# EAGLE design simple_alarm (EAGLE 5.09)
REV: 0.1
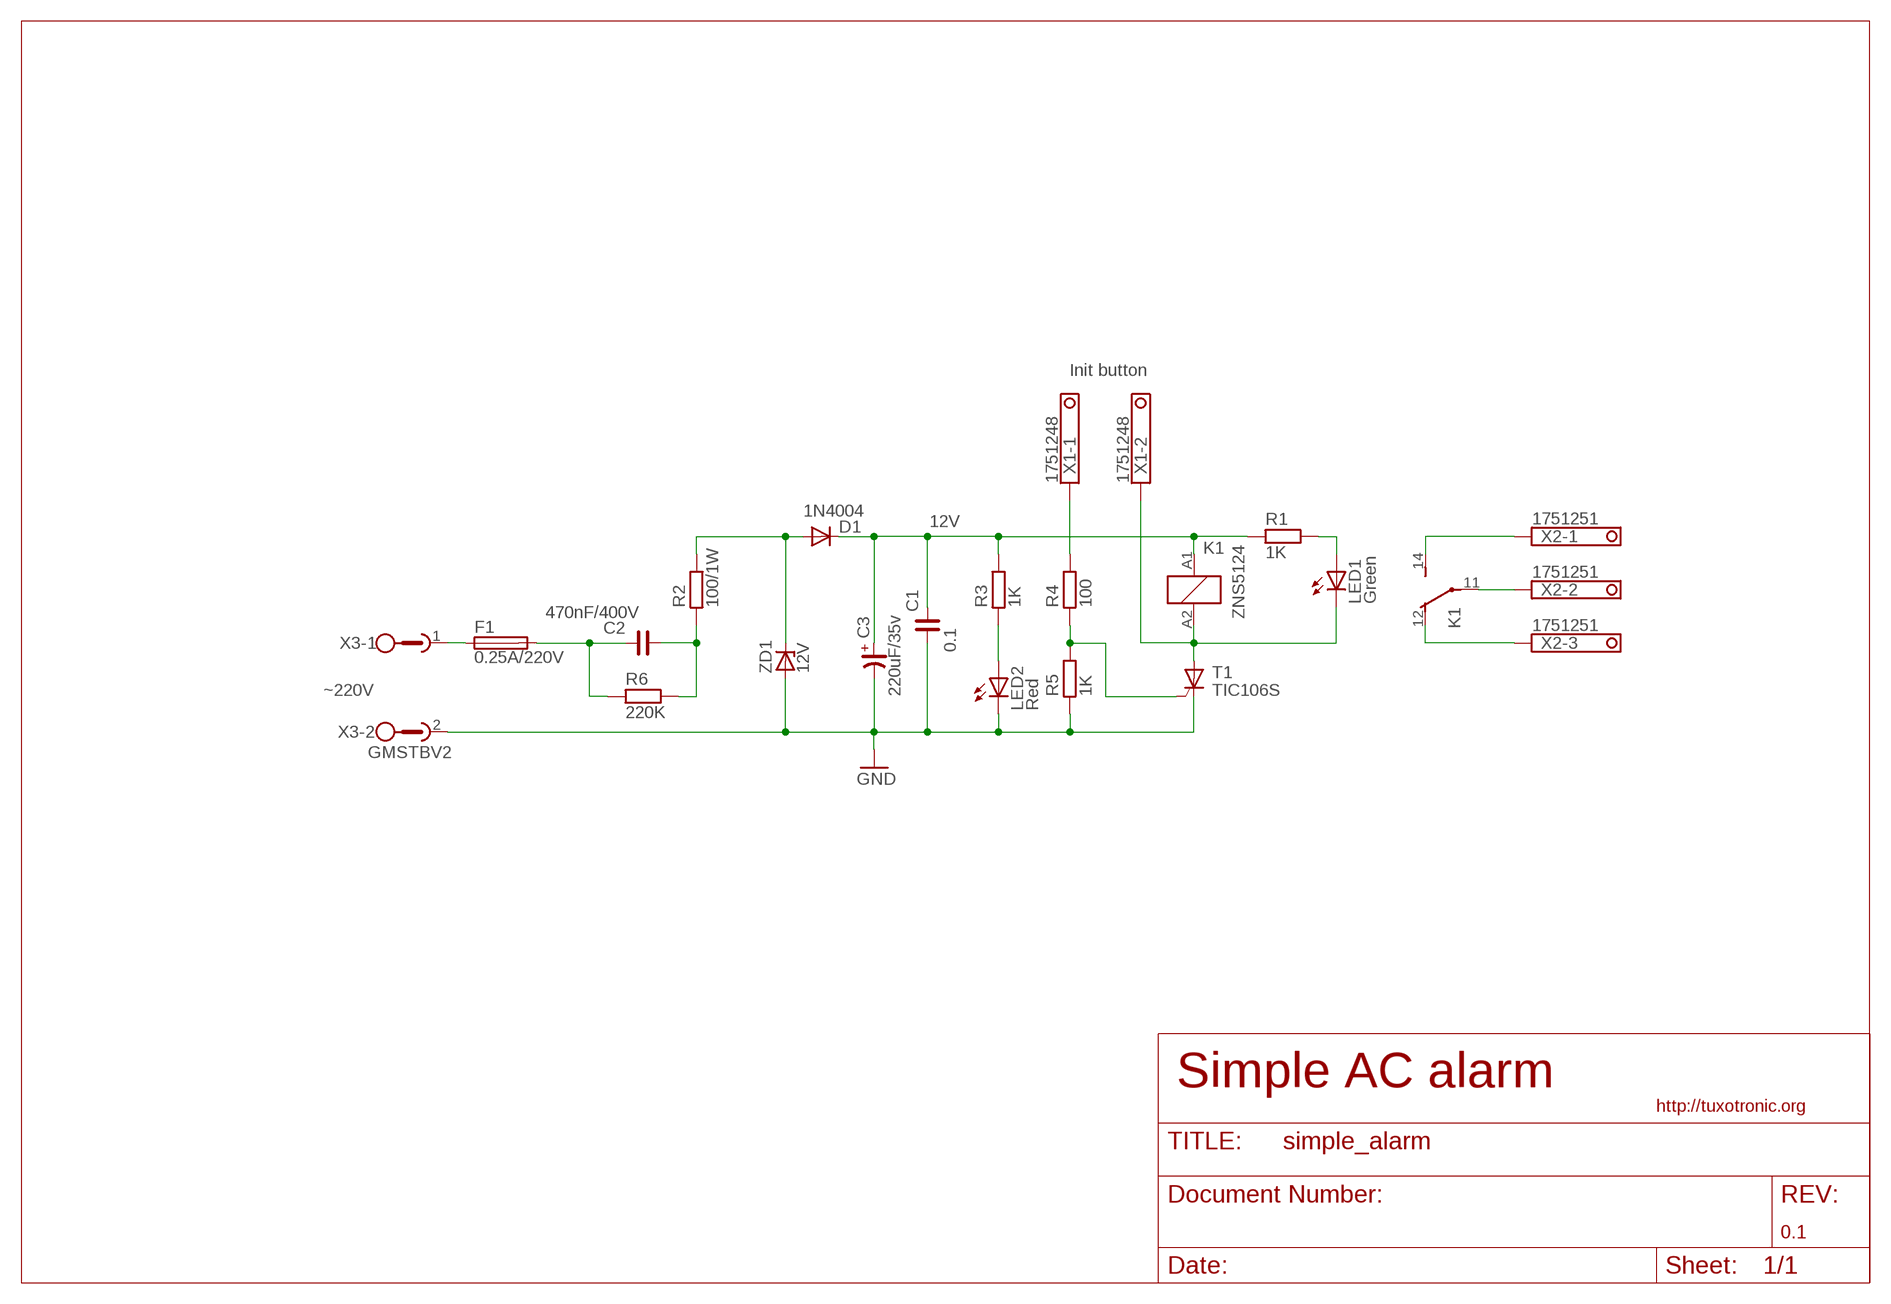
[diagram p0: schematic, sheet 1]

## Parts
C1  0.1  C_C025-050X025  [C025-050X025]
C2  470nF/400V  C_C200-230X080  [C200-230X080]
C3  220uF/35v  CP_TT050-080  [CTT-050-080]
D1  1N4004  DIODE-DO41-10  [DO41-10]
F1  0.25A/220V  PICOFUSE  [PICOFUSE]
K1  ZNS5124  [ZN5]
LED1  Green  LED5MM  [LED5MM]
LED2  Red  LED5MM  [LED5MM]
R1  1K  R_X0309/10  [0309/10]
R2  100/1W  R_X0309/12  [0309/12]
R3  1K  R_X0309/10  [0309/10]
R4  100  R_X0309/10  [0309/10]
R5  1K  R_X0309/10  [0309/10]
R6  220K  R_X0309/10  [0309/10]
T1  TIC106S  [TIC106S]
X1  1751248  [1751248]
X2  1751251  [1751251]
X3  GMSTBV2  [GMSTBV2]
ZD1  12V  BZD23  [SOD81]

## Nets
12V: C1.2 C3.+ D1.C K1.A1 R1.1 R3.2
GND: C1.1 C3.- LED2.K(C) R5.1 T1.C X3.2 ZD1.A
HOT: C2.1 F1.2 R6.1
N$1: F1.1 X3.1
N$2: C2.2 R2.1 R6.2
N$3: D1.A R2.2 ZD1.C
N$4: R4.2 X1.1
N$5: LED2.A R3.1
N$6: K1.A2 LED1.K(C) T1.A X1.2
N$7: R4.1 R5.2 T1.G
N$8: K1.12(2:O) X2.3
N$9: K1.11(2:P) X2.2
N$10: K1.14(2:S) X2.1
N$11: LED1.A R1.2

## Notes on the sheet
- Init button
- ~220V
- Simple AC alarm

## Library data of the parts
C1 C2 = rc-master:C_: NON-POLARIZED CAP
C3 = rc-master:CP_: POLARIZED CAP
D1 = discrete:DIODE-: DIODE
F1 = fuse:PICOFUSE: PICOFUSE 19275, Wickmann
K1 = myrelays:ZNS5*: Miniature Power PCB Relay SCHRACK 1pole 10 A Source: http://www.schrack.com/.. 5847.pdf
LED1 LED2 = led:LED: LED OSRAM: - CHIPLED LG R971, LG N971, LY N971, LG Q971, LY Q971, LO R971, LY R971 LH N974, LH R974 LS Q976, LO Q976, LY Q976 LO Q996 - Hyper CHIPLED LW Q18S LB Q993, LB Q99A, LB R99A - SideLED LS A670, LO A670, LY A670, LG A670, LP A670 LB A673, LV A673, LT A673, LW A673 LH A674 LY A675 LS A676, LA A676, LO A676, LY A676, LW A676 LS A679, LY A679, LG A679 - Hyper Micro SIDELED® LS Y876, LA Y876, LO Y876, LY Y876 LT Y87S - SmartLED LW L88C, LW L88S LB L89C, LB L89S, LG L890 LS L89K, LO L89K, LY L89K LS L896, LA L896, LO L896, LY L896 - TOPLED LS T670, LO T670, LY T670, LG T670, LP T670 LSG T670, LSP T670, LSY T670, LOP T670, LYG T670 LG T671, LOG T671, LSG T671 LB T673, LV T673, LT T673, LW T673 LH T674 LS T676, LA T676, LO T676, LY T676, LB T676, LH T676, LSB T676, LW T676 LB T67C, LV T67C, LT T67C, LS T67K, LO T67K, LY T67K, LW E67C LS E67B, LA E67B, LO E67B, LY E67B, LB E67C, LV E67C, LT E67C LW T67C LS T679, LY T679, LG T679 LS T770, LO T770, LY T770, LG T770, LP T770 LB T773, LV T773, LT T773, LW T773 LH T774 LS E675, LA E675, LY E675, LS T675 LS T776, LA T776, LO T776, LY T776, LB T776 LHGB T686 LT T68C, LB T68C - Hyper Mini TOPLED® LB M676 - Mini TOPLED Santana® LG M470 LS M47K, LO M47K, LY M47K Source: http://www.osram.convergy.de - LUMILED® LXK2-PW12-R00, LXK2-PW12-S00, LXK2-PW14-U00, LXK2-PW14-V00 LXK2-PM12-R00, LXK2-PM12-S00, LXK2-PM14-U00 LXK2-PE12-Q00, LXK2-PE12-R00, LXK2-PE12-S00, LXK2-PE14-T00, LXK2-PE14-U00 LXK2-PB12-K00, LXK2-PB12-L00, LXK2-PB12-M00, LXK2-PB14-N00, LXK2-PB14-P00, LXK2-PB14-Q00 LXK2-PR12-L00, LXK2-PR12-M00, LXK2-PR14-Q00, LXK2-PR14-R00 LXK2-PD12-Q00, LXK2-PD12-R00, LXK2-PD12-S00 LXK2-PH12-R00, LXK2-PH12-S00 LXK2-PL12-P00, LXK2-PL12-Q00, LXK2-PL12-R00 Source: www.luxeon.com
R1-R6 = rc-master:R_: RESISTOR
T1 = triac:TIC106S: THYRISTOR
X1 = con-phoenix-350:1751248: MKDS 1/ 2-3,5 Printklemme Nennstrom: 10 A Bemessungsspannung: 160 V Raster: 3,5 mm Polzahl: 2 Montageart: Löten Anschlussart: Schraubanschluss Anschlussrichtung vom Leiter zur Platine: 0° Source: http://eshop.phoenixcontact.com .. 1751248.pdf
X2 = con-phoenix-350:1751251: MKDS 1/ 3-3,5 Printklemme Nennstrom: 10 A Bemessungsspannung: 160 V Raster: 3,5 mm Polzahl: 3 Montageart: Löten Anschlussart: Schraubanschluss Anschlussrichtung vom Leiter zur Platine: 0° Source: http://eshop.phoenixcontact.com .. 1751251.pdf
X3 = con-phoenix-508:GMSTBV2: PHOENIX
ZD1 = diode:BZD23: Z DIODE

## Board
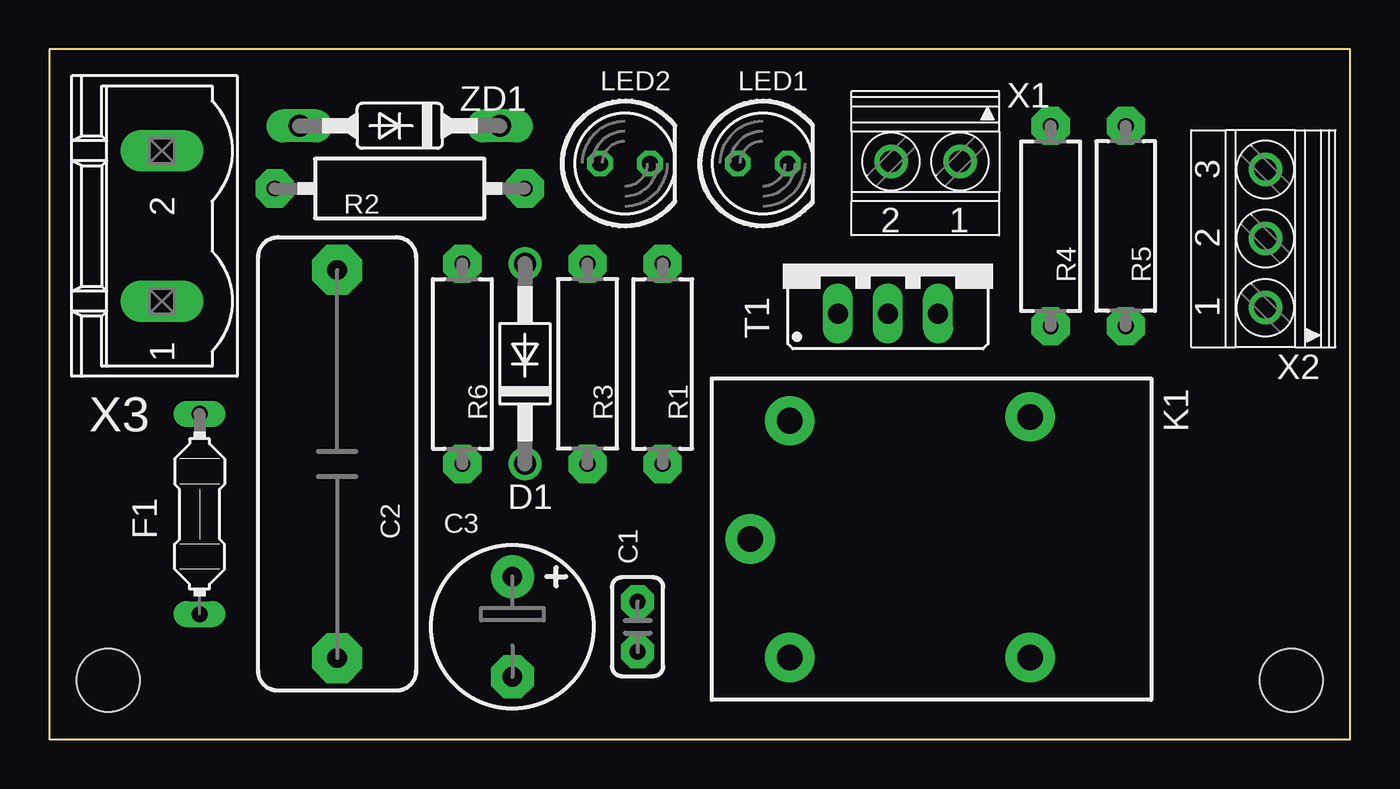
[diagram p1: board, top side]
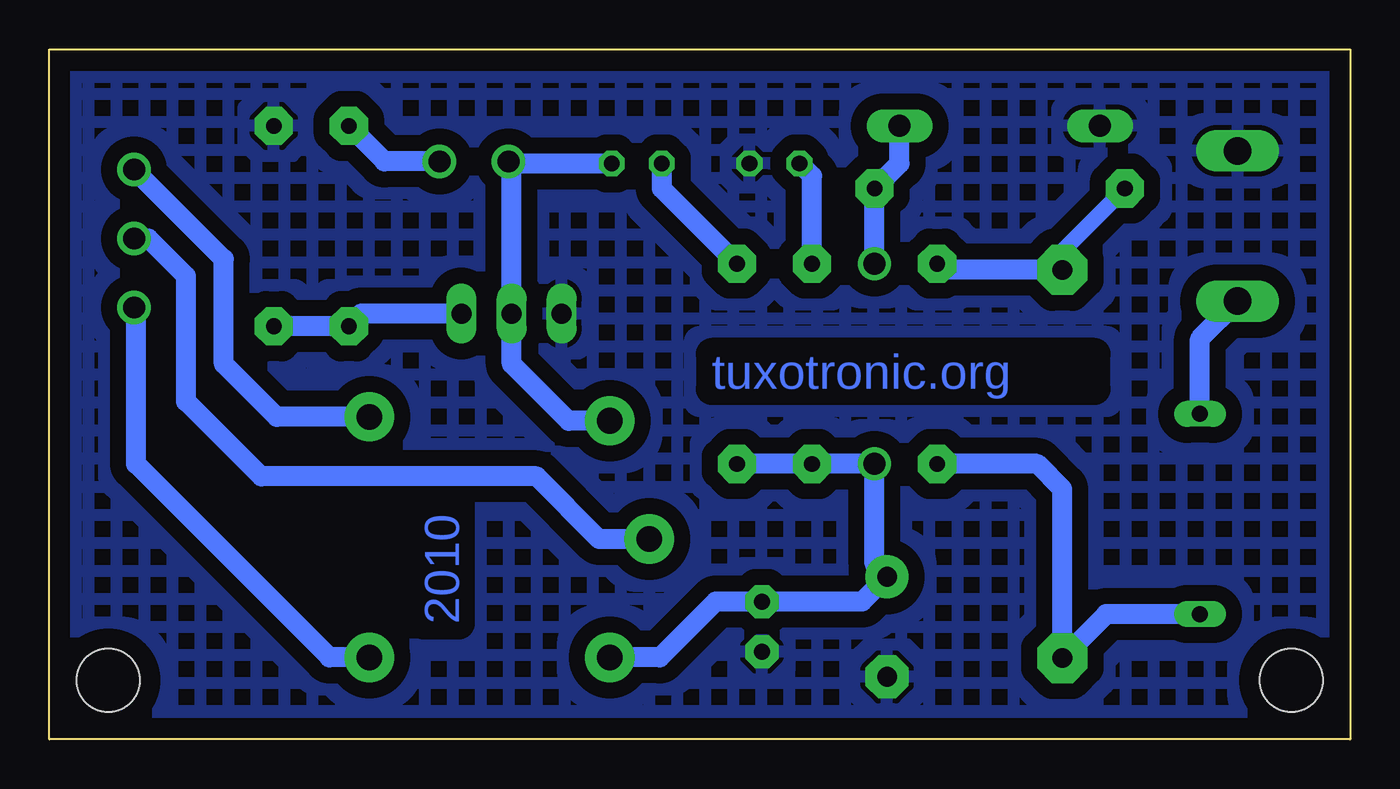
[diagram p2: board, bottom side, seen from below]

Size 66 x 35 mm. Coordinates in mm from the lower left corner, seen from the top.
Outline: 0,0 66,0 66,35 0,35 0,0
Copper layers (1*16): Top 0.035mm / dielectric 1.5mm / Bottom 0.035mm
Design rules "default": minimum track width 10mil, minimum drill 24mil, track to track 8mil, track to pad 8mil, pad to pad 8mil, via to via 8mil, smd to smd 8mil, copper to edge 40mil, drill to drill 8mil, minimum pad ring 10mil, minimum via ring 8mil, stop-mask expansion 4mil, vias tented up to drill 0mil, thermal gap 10mil
Holes 3.2 mm at 3,3 63,3

### Footprints (pad centres in the part's own frame; a part is rotated, then mirrored left to right if it is on the bottom)
C025-050X025 = drill 0.8 pad 1.676 octagon: 1 -1.27,0; 2 1.27,0
C200-230X080 = drill 1 pad 2.54 octagon: 1 -9.842,0; 2 9.842,0
CTT-050-080 = drill 1 pad 2.184 round: + -2.54,0 | drill 1 pad 2.184 octagon: - 2.54,0
DO41-10 = drill 1.118 round: A 5.08,0; C -5.08,0
PICOFUSE = drill 0.813 long: 1 -5.08,0; 2 5.08,0
ZN5 = drill 1.3 pad 2.5 round: 11 8.89,0; 12 -5.31,-6.2; 14 -5.31,6; A1 6.89,6; A2 6.89,-6
LED5MM = drill 0.8 octagon: A -1.27,0; K 1.27,0
0309/10 = drill 0.8 pad 1.93 octagon: 1 -5.08,0; 2 5.08,0
0309/12 = drill 0.8 pad 1.93 octagon: 1 -6.35,0; 2 6.35,0
TIC106S = drill 1.016 long: A 0,-2.54; C -2.54,-2.54; G 2.54,-2.54
1751248 = drill 1.1 pad 1.7 round: 1 -1.75,-0.1; 2 1.75,-0.1
1751251 = drill 1.1 pad 1.7 round: 1 -3.5,-0.1; 2 0,-0.1; 3 3.5,-0.1
GMSTBV2 = drill 1.4 long: 1 -3.81,0; 2 3.81,0
SOD81 = drill 1.118 long: A 5.08,0; C -5.08,0

### Placement (x,y rotation side)
C1  29.84,5.71 90 top
C2  14.61,13.97 90 top
C3  23.5,5.71 270 top
D1  24.13,19.05 90 top
F1  7.62,11.43 270 top
K1  44.45,10.16 180 top
LED1  36.2,29.21 0 top
LED2  29.21,29.21 0 top
R1  31.11,19.05 90 top
R2  17.78,27.94 0 top
R3  27.3,19.05 270 top
R4  50.8,26.04 90 top
R5  54.61,26.04 270 top
R6  20.95,19.05 90 top
T1  42.55,24.13 0 top
X1  44.45,29.21 180 top
X2  61.59,25.4 90 top
X3  5.71,26.04 90 top
ZD1  17.78,31.11 180 top

### Tracks (layer width: path | path; a pad name or v marks a point on that pad's centre or on a via)
12V
  Bottom 1.016: K1.A1 35.02,4.16 32.2,6.99 C1.2 24.77,6.99 C3.+ 24.13,8.89 D1.C R3.2 27.94,13.97 R1.1
GND
  pour Bottom (isolate 0.813, hatched): 0.64,33.66 65.41,33.66 65.41,0.64 0.64,0.64
HOT
  Bottom 1.016: F1.2 12.38,6.35 C2.1 14.61,12.7 15.88,13.97 R6.1
N$1
  Bottom 1.016: F1.1 7.62,20.32 X3.1
N$2
  Bottom 0.813: C2.2 14.61,24.77 R2.1
  Bottom 1.016: C2.2 20.64,23.81 R6.2
N$3
  Bottom 1.016: ZD1.C 22.86,29.21 R2.2 D1.A
N$4
  Bottom 1.016: X1.1 48.99,29.31 R4.2
N$5
  Bottom 1.016: R3.1 27.3,28.57 LED2.A
N$6
  Bottom 1.016: K1.A2 39.66,16.16 42.55,19.05 T1.A 42.55,29.16 X1.2 42.6,29.21 LED1.K
N$7
  Bottom 1.016: T1.G 50.16,21.59 R4.1 R5.2
N$8
  Bottom 1.016: X2.3 57.15,24.36 57.15,19.05 54.46,16.36 K1.12
N$9
  Bottom 1.016: X2.2 60.96,25.4 59.05,23.5 59.05,17.14 55.24,13.34 41.27,13.34 38.1,10.16 K1.11
N$10
  Bottom 1.016: K1.14 51.78,4.16 61.59,13.97 61.59,21.8 X2.1
N$11
  Bottom 1.016: LED1.A 34.92,27.94 R1.2

### Text on the board
Bottom: tuxotronic.org | 2010